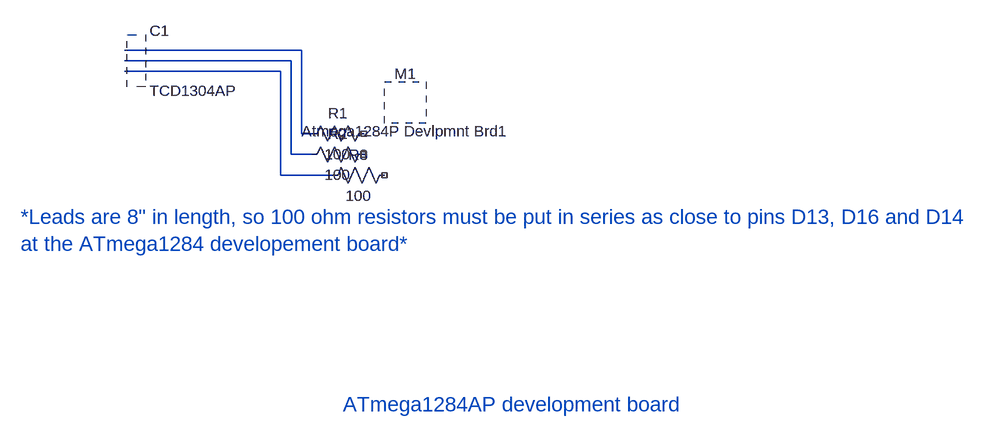
[diagram p0: schematic Exploded view TCD1304 100 ohm fix to MCU mar5.asc]
Exploded view TCD1304 100 ohm fix to MCU mar5.asc, the LTspice schematic file:
Version 4
SHEET 1 880 680
WIRE -112 -80 -384 -80
WIRE -128 -64 -384 -64
WIRE -144 -48 -384 -48
WIRE -112 48 -112 -80
WIRE -96 48 -112 48
WIRE -128 80 -128 -64
WIRE -96 80 -128 80
WIRE -144 112 -144 -48
WIRE -64 112 -144 112
SYMBOL Misc\\Atmega1284P\ Devlpmnt\ Brd1 48 0 R0
SYMATTR InstName M1
SYMBOL Misc\\TCD1304AP -416 -64 R0
SYMATTR InstName C1
SYMBOL res 0 32 R90
WINDOW 0 0 56 VBottom 2
WINDOW 3 32 56 VTop 2
SYMATTR InstName R1
SYMATTR Value 100
SYMBOL res 0 64 R90
WINDOW 0 0 56 VBottom 2
WINDOW 3 32 56 VTop 2
SYMATTR InstName R2
SYMATTR Value 100
SYMBOL res 32 96 R90
WINDOW 0 0 56 VBottom 2
WINDOW 3 32 56 VTop 2
SYMATTR InstName R3
SYMATTR Value 100
TEXT -544 176 Left 3 ;*Leads are 8" in length, so 100 ohm resistors must be put in series as close to pins D13, D16 and D14\nat the ATmega1284 developement board*
TEXT -48 464 Left 3 ;ATmega1284AP development board

The netlist it stands for:
* Exploded view TCD1304 100 ohm fix to MCU mar5.asc
* M1: Atmega1284P Devlpmnt Brd1 (symbol Misc\Atmega1284P Devlpmnt Brd1 not available, pin order unknown); nets seen at it: 
* C1: TCD1304AP (symbol Misc\TCD1304AP not available, pin order unknown); nets seen at it: N001, N002, N003
R1 NC_01 N001 100
R2 NC_02 N002 100
R3 NC_03 N003 100
* *Leads are 8" in length, so 100 ohm resistors must be put in series as close to pins D13, D16 and D14
* at the ATmega1284 developement board*
* ATmega1284AP development board
.backanno
.end